# Altium schematic sheet stepper-schematic.SchDoc
size 381 x 241 mm; SheetNumber: 3; SheetTotal: 3
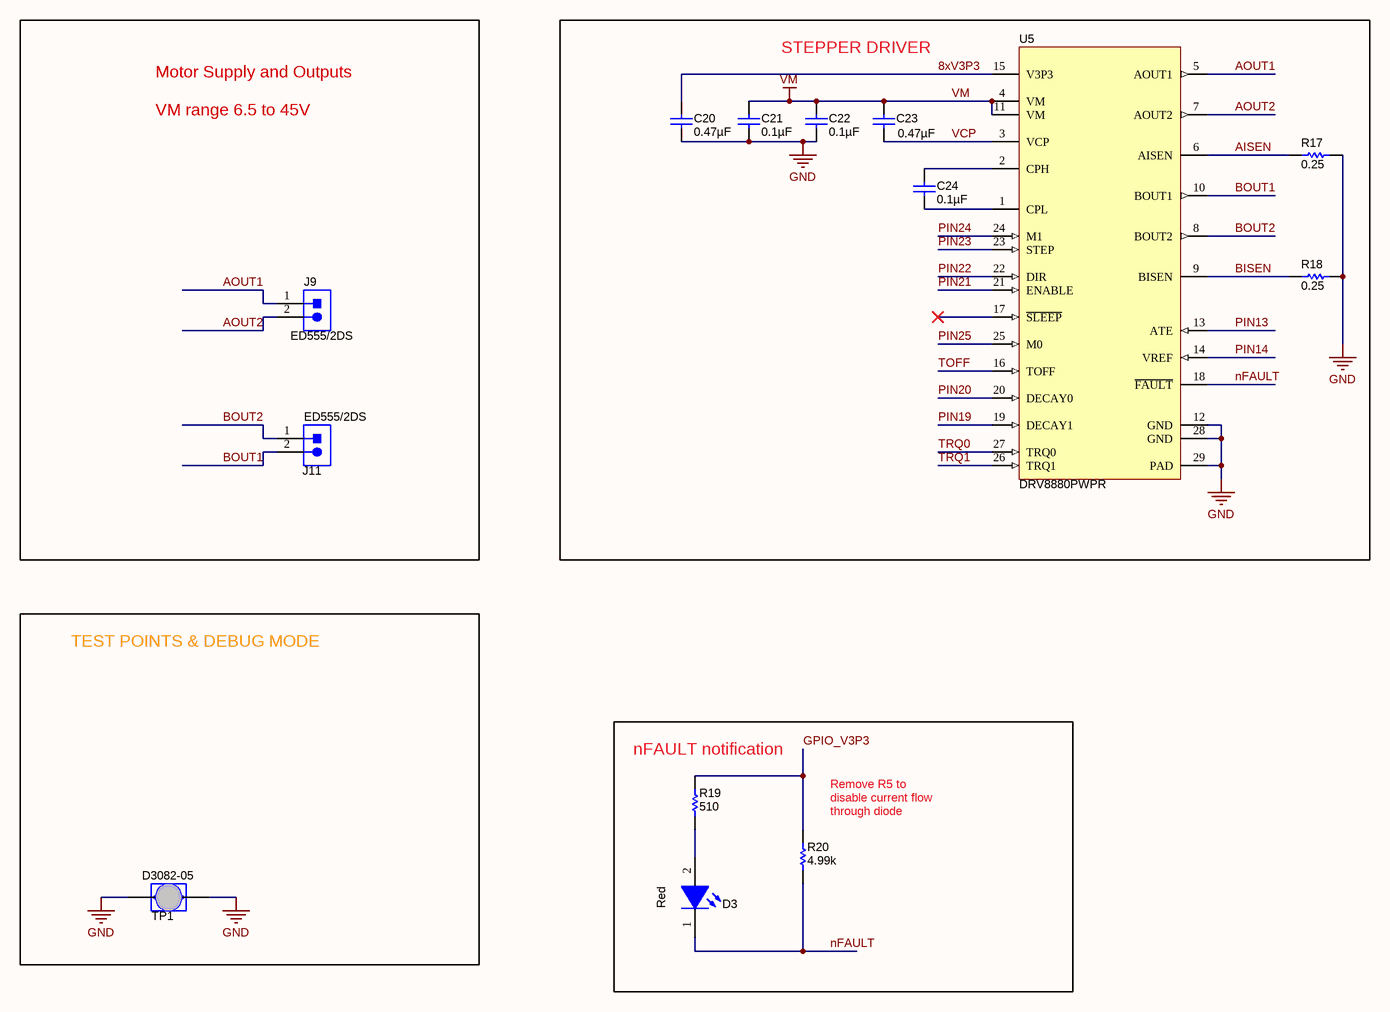
[diagram p0: stepper-schematic.SchDoc]

## Parts
C20  ValueDisplayed: 0.47µF  [0603L]  (hidden comment: C0603C474K9RACTU)
C21  ValueDisplayed: 0.1µF  [0805L]  (hidden comment: C0805C104K1RACTU)
C22  ValueDisplayed: 0.1µF  [0805L]  (hidden comment: C0805C104K1RACTU)
C23  ValueDisplayed: 0.47µF  [0805L]  (hidden comment: C2012X7R1E474K)
C24  ValueDisplayed: 0.1µF  [0805L]  (hidden comment: C0805C104K1RACTU)
D3  value Red  [WL-SMCW_RED]  (hidden comment: 150060RS75000)
J9  ED555/2DS  [TERM_BLK_ED555-2DS]
J11  ED555/2DS  [TERM_BLK_ED555-2DS]
R17  value 0.25  [2010L]  (hidden comment: CSRN2010FKR250)
R18  value 0.25  [2010L]  (hidden comment: CSRN2010FKR250)
R19  value 510  [0402L]  (hidden comment: CRCW0402510RJNED)
R20  value 4.99k  [0402L]  (hidden comment: CRCW04024K99FKED)
TP1  D3082-05  [Harwin_D3082-05]
U5  DRV8880PWPR  [PWP0028C_N]

## Blocks framed on the sheet
STEPPER DRIVER: C20-C24 R17 R18 U5
TEST POINTS & DEBUG MODE: TP1
nFAULT notification: D3 R19 R20

## Nets
GND: C20.2 C21.1 C22.1 R17.1 R18.1 TP1.1 TP1.2 U5.12(GND) U5.28(GND) U5.29(PAD)
VM: C21.2 C22.2 C23.2 U5.4(VM) U5.11(VM)
8xV3P3: C20.1 U5.15(V3P3)
AISEN: R17.2 U5.6(AISEN)
AOUT1: J9.1 U5.5(AOUT1)
AOUT2: J9.2 U5.7(AOUT2)
BISEN: R18.2 U5.9(BISEN)
BOUT1: J11.2 U5.10(BOUT1)
BOUT2: J11.1 U5.8(BOUT2)
GPIO_V3P3: R19.2 R20.2
nFAULT: D3.1(K) R20.1 U5.18(~{FAULT})
PIN13: U5.13(ATE)
PIN14: U5.14(VREF)
PIN19: U5.19(DECAY1)
PIN20: U5.20(DECAY0)
PIN21: U5.21(ENABLE)
PIN22: U5.22(DIR)
PIN23: U5.23(STEP)
PIN24: U5.24(M1)
PIN25: U5.25(M0)
TOFF: U5.16(TOFF)
TRQ0: U5.27(TRQ0)
TRQ1: U5.26(TRQ1)
VCP: C23.1 U5.3(VCP)
NetC24_1: C24.1 U5.1(CPL)
NetC24_2: C24.2 U5.2(CPH)
NetD3_2: D3.2(A) R19.1

Not connected (* = marked no-connect by the designer): U5 17(~{SLEEP})*

## Notes on the sheet
- Motor Supply and Outputs
  VM range 6.5 to 45V
- (near R20) Remove R5 to disable current flow through diode

## Library data of the parts
C20 = C0603C474K9RACTU: CAP, CERM, 0.47 µF, 6.3 V, +/- 10%, X7R, 0603; Manufacturer: Kemet; Polarized: N; CompType: Capacitor; Value: 0.47uF; U/M: EA; Cap_F: 0.00000047; Tolerance_%: 10; Value1: Unknown; VDC_V: 6.3; Value2: 6.3V; TaMin_C: -55; TaMax_C: 125; Cap_Case: 0603; SymbolVersion: 2008-07-09; PartNumber: C0603C474K9RACTU; PackageReference: 0603; RoHS: Y; MountType: SMT; Technology: Ceramic; TempCo: X7R; Published: 2008-06-19; Publisher: Texas Instruments; LatestRevisionDate: 2015-06-10; ComponentLink1Description: Datasheet link; ComponentLink1URL: http://www.kemet.com/kemet/web/homepage/kechome.nsf/vapubfiles/F3102_Y5V.pdf/$file/F3102_Y5V.pdf; Supplier 1: Digi-Key; Supplier Part Number 1: 399-4924-1-ND; Supplier 2: Mouser; Supplier Part Number 2: 80-C0603C474K9R
C21 C22 C24 = C0805C104K1RACTU: CAP, CERM, 0.1 µF, 100 V, +/- 10%, X7R, 0805; Manufacturer: Kemet; Polarized: N; CompType: Capacitor; Value: 0.1uF; U/M: EA; Cap_F: 0.0000001; Tolerance_%: 10; ESR_ohm: 0.064; Value1: 0.064 ohm; VDC_V: 100; Value2: 100V; IRMS_A: 1.64; TaMin_C: -55; TaMax_C: 125; Cap_Case: 0805; SymbolVersion: 2008-07-09; PartNumber: C0805C104K1RACTU; PackageReference: 0805; RoHS: Y; MountType: SMT; Technology: Ceramic; TempCo: X7R; Published: 2008-06-19; Publisher: Texas Instruments; LatestRevisionDate: 2015-06-10; ComponentLink1Description: Datasheet link; ComponentLink1URL: http://www.kemet.com/kemet/web/homepage/kechome.nsf/file/Partial%20Copy%20-%20Ceramic%20Surface%20Mount%20Capacitors/$file/F3102_CE.pdf; Supplier 1: Digi-Key; Supplier Part Number 1: 399-3486-1-ND; Supplier 2: Mouser; Supplier Part Number 2: 80-C0805C104K1R; Supplier 3: Farnell; Supplier Part Number 3: 1650862
C23 = C2012X7R1E474K: CAP, CERM, 0.47 µF, 25 V, +/- 10%, X7R, 0805; Manufacturer: TDK; Polarized: N; CompType: Capacitor; Value: 0.47uF; U/M: EA; Cap_F: 0.00000047; Tolerance_%: 10; ESR_ohm: 0.0101; Value1: 0.0101 ohm; VDC_V: 25; Value2: 25V; TaMin_C: -55; TaMax_C: 125; Cap_Case: 0805; SymbolVersion: 2008-07-09; PartNumber: C2012X7R1E474K; PackageReference: 0805; RoHS: Y; MountType: SMT; Technology: Ceramic; TempCo: X7R; Published: 2008-06-19; Publisher: Texas Instruments; LatestRevisionDate: 2015-06-10; ComponentLink1Description: Datasheet link; ComponentLink1URL: http://www.tdk.co.jp/tefe02/e412_c.pdf; Supplier 1: Digi-Key; Supplier Part Number 1: 445-1353-1-ND; Supplier 2: Farnell; Supplier Part Number 2: 1844282
D3 = CMP-0002947-2: LED, Red, SMD; Manufacturer: Wurth Elektronik; Type: AlInGaP; Vf_V: 2V; Io_A: 30mA; Vr_V: 5V; Tjmax_C: 85°C; Power_TotalModule: 72mW; Value1: 0.072W; Angle: 140; U/M: EA; CompType: LED; PartNumber: 150060RS75000; MountType: SMT; RoHS: Y; PackageReference: LED_0603; Value2: 2V; Color: Red; Published: 2008-07-11; Publisher: Texas Instruments; ComponentLink1URL: http://katalog.we-online.de/led/datasheet/150060RS75000.pdf; ComponentLink1Description: Datasheet link; LatestRevisionDate: 2017-03-09; Supplier 1: Digi-Key; Supplier Part Number 1: 732-4978-1-ND; Supplier 2: Newark; Supplier Part Number 2: 95W3795; Supplier 3: Mouser; Supplier Part Number 3: 710-150060RS75000
J9 J11 = ED555/2DS: Terminal Block, 6A, 3.5mm Pitch, 2-Pos, TH; Manufacturer: On-Shore Technology; SymbolCreator: a0412235; CompType: Connector; U/M: EA; ComponentLink1URL: http://on-shore.com/sites/default/files/manuals/ed555ds.pdf; SymbolVersion: 2013-10-31; PackageReference: 7.0x8.2x6.5mm; PartNumber: ED555/2DS; ComponentLink1Description: Datasheet Link; RoHS: Y; MountType: TH; Publisher: Texas Instruments; LatestRevisionDate: 2015-06-10; Supplier 1: Digi-Key; Supplier Part Number 1: ED1514-ND
R17 R18 = CSRN2010FKR250: RES, 0.25, 1%, 1 W, 2010; Manufacturer: Stackpole Electronics Inc; CompType: Resistor; Value_Code: R250; Tolerance_%: 1; Value2: 1W; TempCo: 250 ppm/C; U/M: EA; SymbolVersion: 2009-05-29; PartNumber: CSRN2010FKR250; PackageReference: 2010; RoHS: Y; Res_ohm: 0.25; Value1: 1%; Power_W: 1; MountType: SMT; Technology: Thick Film; Published: 2008-06-26; Publisher: Texas Instruments; LatestRevisionDate: 2015-04-13; ComponentLink1Description: Datasheet link; ComponentLink1URL: http://www.seielect.com/Catalog/SEI-csr.pdf; Supplier 1: Digi-Key; Supplier Part Number 1: CSRN2010FKR250CT-ND; ValueDisplayed: 0.25
R19 = CRCW0402510RJNED: RES, 510, 5%, 0.063 W, 0402; Manufacturer: Vishay-Dale; CompType: Resistor; Value_Code: 510R; Tolerance_%: 5; Power_W: 0.063; Value2: 0.063W; VDC_V: 50; TempCo: 200 ppm/C; EIA_Code: E24; U/M: EA; SymbolVersion: 2009-05-29; PartNumber: CRCW0402510RJNED; PackageReference: 0402; RoHS: Y; Res_ohm: 510; Value1: 5%; MountType: SMT; Technology: Thick Film; Published: 2008-06-26; Publisher: Texas Instruments; LatestRevisionDate: 2015-05-27; ComponentLink1Description: Datasheet link; ComponentLink1URL: http://www.vishay.com/docs/20035/dcrcwe3.pdf; Supplier 1: Digi-Key; Supplier Part Number 1: 541-510JCT-ND; Supplier 2: Mouser; Supplier Part Number 2: 71-CRCW0402J-510-E3; Supplier 3: Farnell; Supplier Part Number 3: 1570682; ValueDisplayed: 510
R20 = CRCW04024K99FKED: RES, 4.99 k, 1%, 0.063 W, 0402; Manufacturer: Vishay-Dale; CompType: Resistor; Res_ohm: 4990; Value_Code: 4k99; Tolerance_%: 1; Power_W: 0.063; Value2: 0.063W; VDC_V: 50; TempCo: 100 ppm/C; EIA_Code: E96; U/M: EA; SymbolVersion: 2009-05-29; PartNumber: CRCW04024K99FKED; PackageReference: 0402; RoHS: Y; Value1: 1%; MountType: SMT; Technology: Thick Film; Published: 2008-06-26; Publisher: Texas Instruments; LatestRevisionDate: 2015-05-27; ComponentLink1Description: Datasheet link; ComponentLink1URL: http://www.vishay.com/docs/20035/dcrcwe3.pdf; Supplier 1: Digi-Key; Supplier Part Number 1: 541-4.99KLCT-ND; Supplier 2: Mouser; Supplier Part Number 2: 71-CRCW0402-4.99K-E3; Supplier 3: Farnell; Supplier Part Number 3: 1469715; ValueDisplayed: 4.99k
TP1 = D3082-05: 1mm Uninsulated Shorting Plug, 10.16mm spacing, TH; Manufacturer: Harwin; SymbolCreator: a0799628; CompType: Jumper Wire; U/M: EA; SymbolVersion: 2014-05-16; MountType: TH; RoHS: Y; PartNumber: D3082-05; PackageReference: Shorting Plug, 10.16mm spacing, TH; ComponentLink1Description: Datasheet Link; ComponentLink1URL: http://cdn.harwin.com/pdfs/D3080-D3083.pdf; Supplier 1: Digi-Key; Supplier 2: Mouser; Supplier Part Number 1: 952-1873-ND; Supplier Part Number 2: 855-D3082-05; Publisher: Texas Instruments; LatestRevisionDate: 2015-06-10
U5 = DRV8880PWPR: 2-A 45-V 1/16-μstep Stepper Motor Driver With AutoTune, PWP0028C; Manufacturer: Texas Instruments; SymbolCreator: Altium; CompType: IC; U/M: EA; SymbolVersion: 2015-05-04; PartNumber: DRV8880PWPR; Alternate PartNumber: DRV8880PWP; PackageReference: PWP0028C; MountType: SMT; ComponentLink1Description: Datasheet Link; ComponentLink1URL: https://sps06.itg.ti.com/sites/KMS/crossdivteams/altium/docs/ComponentDatasheets/SLVSD18_060515.pdf; Publisher: Texas Instruments; LatestRevisionDate: 2015-06-11; Alternate Manufacturer: Texas Instruments